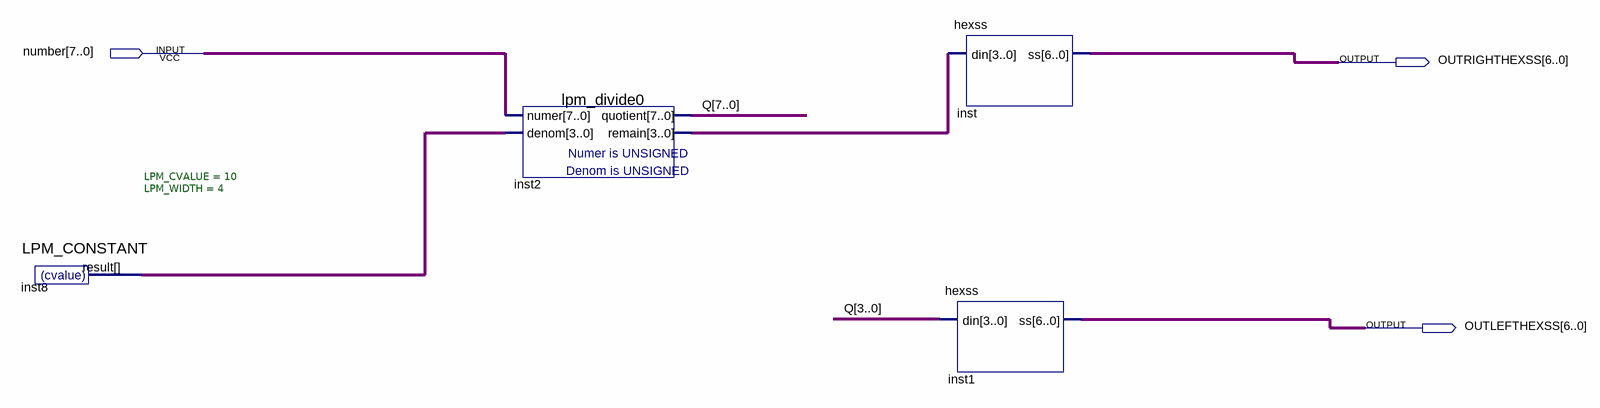
[diagram p0: schematic sheet]
// Quartus schematic DivideHexss.bdf as structural Verilog: 4 symbols, 3 pins
module DivideHexss (
  input  [7:0] number,
  output [6:0] OUTRIGHTHEXSS,
  output [6:0] OUTLEFTHEXSS
);

  wire [3:0] inst2_remain, inst8_result;
  wire [7:0] Q;

  LPM_CONSTANT #(.LPM_CVALUE(10), .LPM_WIDTH(4)) inst8 (.result(inst8_result));
  lpm_divide0 inst2 (.numer(number), .denom(inst8_result), .quotient(Q), .remain(inst2_remain));
  hexss inst (.din(inst2_remain), .ss(OUTRIGHTHEXSS));
  hexss inst1 (.din(Q[3:0]), .ss(OUTLEFTHEXSS));
endmodule
